# EasyEDA Pro project ProPrj_无线即时通信_2025-03-31.epro, board PCB2
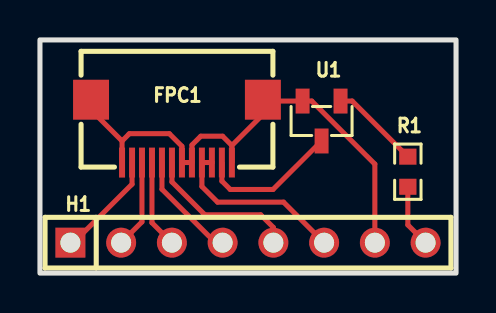
[diagram p2: board, top side]
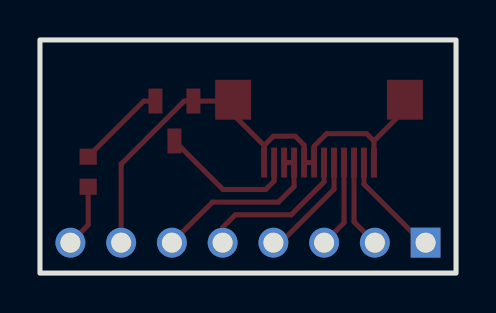
[diagram p3: board, bottom side, seen from below]

Outline 20.83 x 11.68 mm; copper layers: Top Layer, Bottom Layer. Coordinates in mm from the lower left corner of the outline.
Outline path: rectangle 0,11.68 20.83,0
Stack: Top Layer 0.035mm / Dielectric1 1.51mm FR4 er 4.5 / Bottom Layer 0.035mm

## Design rules (mm)
template: JLCPCB Capability(Two Layers Board)
spacing copperThickness1oz (default): track to track 0.102, other pairs 0.152 to 0.3
spacing copperThickness2oz: track to track 0.203, other pairs 0.152 to 0.3
track width copperThickness1oz (default): min 0.127, default 0.254, max 2.54
track width copperThickness2oz: min 0.203, default 0.254, max 2.54
differential pair differentialPair (default): width min 0.127, default 0.254, max 2.54; gap min 0.152, default 0.152
via viaSize (default): diameter min 0.5, default 0.61, max 10; hole min 0.3, default 0.305, max 6.3

## Placement (name value [footprint] x y rotation side)
FPC1  AFC24-S12FIC-00  [FPC-SMD_P0.50-12P_QCHF-SM-H2.0]  6.86 7.11 0 top
H1  PZ254V-11-08P  [HDR-TH_8P-P2.54-V-M]  10.41 1.52 0 top
R1  2.2k  [R0603]  18.42 5.08 90 top
U1  SS8050  [SOT-23-3_L2.9-W1.3-P1.90-LS2.4-BR]  14.1 7.62 90 top

## Footprints (pads in the part's own frame, mm; a bottom-side part is the same pattern mirrored in y, then rotated)
FPC-SMD_P0.50-12P_QCHF-SM-H2.0
  rect 0.3x1.5 smd: 1(2.749,-1.573) 2(2.248,-1.573) 3(1.749,-1.573) 4(1.248,-1.573) 5(0.749,-1.573) 6(0.248,-1.573) 7(-0.251,-1.573) 8(-0.751,-1.573) 9(-1.251,-1.573) 10(-1.752,-1.573) 11(-2.248,-1.575) 12(-2.748,-1.575)
  rect 1.8x2 smd: 13(4.301,1.575) 14(-4.301,1.575)
HDR-TH_8P-P2.54-V-M
  rect 1.5x1.5 hole 1: 1(-8.89,0)
  round 1.5 hole 1: 2(-6.35,0) 3(-3.81,0) 4(-1.27,0) 5(1.27,0) 6(3.81,0) 7(6.35,0) 8(8.89,0)
R0603
  rect 0.806x0.864 smd: 1(-0.753,0) 2(0.753,0)
SOT-23-3_L2.9-W1.3-P1.90-LS2.4-BR
  rect 1.25x0.7 smd: 1(1,-0.95) 2(1,0.95) 3(-1,0)

## Nets
As in the schematic.

## Routing (per net, layer and track width the routed paths; a pad name or vN(x,y) marks a point on that pad's centre or on a via; arc(x,y) is an arc through that point)
3V3: length 9
  Top Layer w0.254: H1.6 12.19,3.56 8.89,3.56 8.11,4.34 FPC1.4 FPC1.3
GND: length 26.4
  Top Layer w0.254: FPC1.14 2.56,8.17 4.11,6.62 ; 4.11,6.62 4.47,6.98 6.48,6.98 7.11,6.36 FPC1.6 FPC1.5 7.61,6.42 8.05,6.86 9.14,6.86 9.61,6.39 ; 4.11,6.62 FPC1.12 ; 9.61,6.39 FPC1.1 ; 9.61,6.39 11.16,7.95 FPC1.13 11.44,8.69 11.51,8.62 U1.2 13.61,8.62 16.76,5.46 H1.7
BL: length 3.2
  Top Layer w0.254: H1.8 18.42,2.41 R1.1
CS: length 5.5
  Top Layer w0.254: H1.4 8.78,1.52 6.11,4.2 FPC1.8
DC: length 7.8
  Top Layer w0.254: FPC1.7 6.61,4.57 8.26,2.92 11.05,2.92 11.68,2.29 H1.5
LEDK: length 7.1
  Top Layer w0.254: U1.3 11.67,4.19 9.53,4.19 9.11,4.61 FPC1.2
RESET: length 5.4
  Top Layer w0.254: FPC1.11 4.61,4.46 1.68,1.52 H1.1
SCL: length 4.4
  Top Layer w0.254: H1.3 5.61,2.52 FPC1.9
SDA: length 4.4
  Top Layer w0.254: FPC1.10 5.11,2.57 H1.2
$1N486: length 4.5
  Top Layer w0.254: U1.1 15.63,8.62 R1.2
